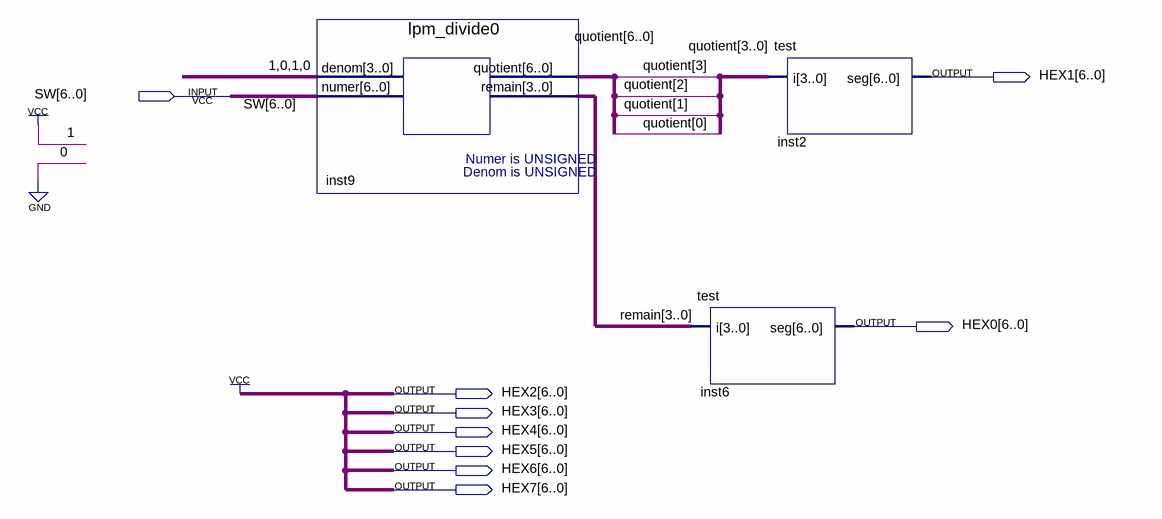
[diagram p0: schematic sheet]
// Quartus schematic Lab3.bdf as structural Verilog: 3 symbols, 9 pins
module Lab3 (
  input  [6:0] SW,
  output [6:0] HEX1,
  output [6:0] HEX0,
  output [6:0] HEX2,
  output [6:0] HEX3,
  output [6:0] HEX4,
  output [6:0] HEX5,
  output [6:0] HEX6,
  output [6:0] HEX7
);

  wire [3:0] remain;
  wire [6:0] quotient;

  lpm_divide0 inst9 (.denom(4'b1010), .numer(SW), .quotient(quotient), .remain(remain));
  test inst6 (.i(remain), .seg(HEX0));
  test inst2 (.i(quotient[3:0]), .seg(HEX1));

  assign HEX2 = {7{1'b1}};
  assign HEX3 = {7{1'b1}};
  assign HEX4 = {7{1'b1}};
  assign HEX5 = {7{1'b1}};
  assign HEX6 = {7{1'b1}};
  assign HEX7 = {7{1'b1}};
endmodule
